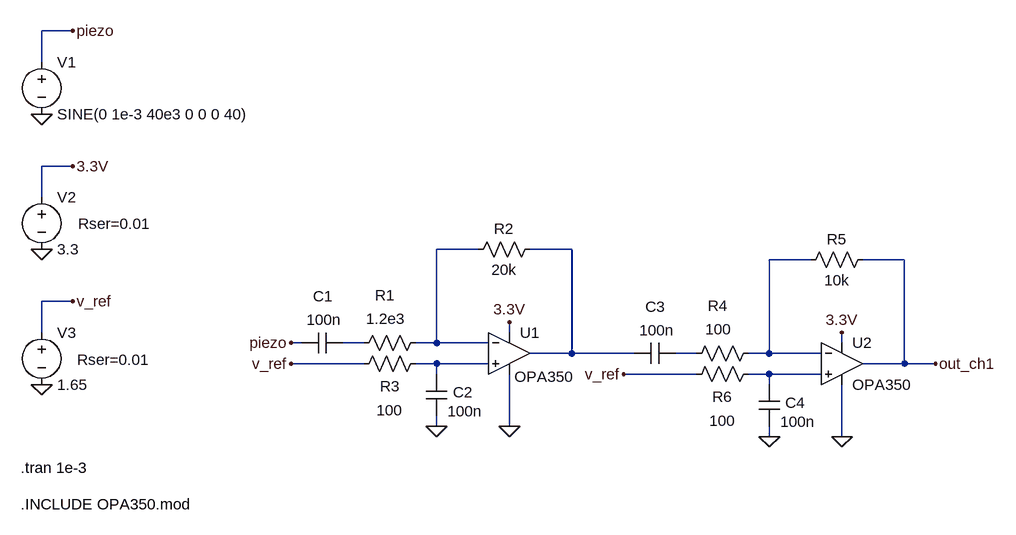
[diagram p0: schematic P6.asc]
P6.asc, the LTspice schematic file:
Version 4
SHEET 1 1124 680
WIRE -688 -96 -736 -96
WIRE -736 -48 -736 -96
WIRE -688 112 -736 112
WIRE -736 160 -736 112
WIRE -64 240 -128 240
WIRE 80 240 16 240
WIRE 448 256 384 256
WIRE 592 256 528 256
WIRE -688 320 -736 320
WIRE -736 368 -736 320
WIRE -16 368 -16 352
WIRE -336 384 -352 384
WIRE -240 384 -272 384
WIRE -128 384 -128 240
WIRE -128 384 -160 384
WIRE -48 384 -128 384
WIRE 496 384 496 368
WIRE 80 400 80 240
WIRE 80 400 16 400
WIRE 176 400 80 400
WIRE 272 400 240 400
WIRE 384 400 384 256
WIRE 384 400 352 400
WIRE 464 400 384 400
WIRE -240 416 -352 416
WIRE -128 416 -160 416
WIRE -48 416 -128 416
WIRE 592 416 592 256
WIRE 592 416 528 416
WIRE 640 416 592 416
WIRE -128 432 -128 416
WIRE 272 432 160 432
WIRE 384 432 352 432
WIRE 464 432 384 432
WIRE 384 448 384 432
WIRE -128 512 -128 496
WIRE -16 512 -16 432
WIRE 384 528 384 512
WIRE 496 528 496 448
FLAG -736 32 0
FLAG -688 -96 piezo
FLAG -736 240 0
FLAG -688 112 3.3V
FLAG -16 512 0
FLAG -16 352 3.3V
FLAG -736 448 0
FLAG -688 320 v_ref
FLAG -352 384 piezo
FLAG -352 416 v_ref
FLAG -128 512 0
FLAG 496 528 0
FLAG 496 368 3.3V
FLAG 160 432 v_ref
FLAG 384 528 0
FLAG 640 416 out_ch1
SYMBOL voltage -736 -64 R0
WINDOW 123 0 0 Left 2
WINDOW 39 0 0 Left 2
SYMATTR InstName V1
SYMATTR Value SINE(0 1e-3 40e3 0 0 0 40)
SYMBOL voltage -736 144 R0
WINDOW 123 0 0 Left 2
WINDOW 39 56 57 Left 2
SYMATTR SpiceLine Rser=0.01
SYMATTR InstName V2
SYMATTR Value 3.3
SYMBOL voltage -736 352 R0
WINDOW 123 0 0 Left 2
WINDOW 39 55 58 Left 2
SYMATTR SpiceLine Rser=0.01
SYMATTR InstName V3
SYMATTR Value 1.65
SYMBOL res -144 368 R90
WINDOW 0 -42 63 VBottom 2
WINDOW 3 -37 62 VTop 2
SYMATTR InstName R1
SYMATTR Value 1.2e3
SYMBOL cap -272 368 R90
WINDOW 0 -40 31 VBottom 2
WINDOW 3 -35 29 VTop 2
SYMATTR InstName C1
SYMATTR Value 100n
SYMBOL res 32 224 R90
WINDOW 0 0 56 VBottom 2
WINDOW 3 32 56 VTop 2
SYMATTR InstName R2
SYMATTR Value 20k
SYMBOL res -144 400 R90
WINDOW 0 66 56 VBottom 2
WINDOW 3 72 56 VTop 2
SYMATTR InstName R3
SYMATTR Value 100
SYMBOL cap -144 432 R0
WINDOW 0 41 28 Left 2
WINDOW 3 33 57 Left 2
SYMATTR InstName C2
SYMATTR Value 100n
SYMBOL Opamps\\opamp2 -16 336 R0
WINDOW 3 8 100 Left 2
SYMATTR InstName U1
SYMATTR Value OPA350
SYMBOL res 368 384 R90
WINDOW 0 -42 63 VBottom 2
WINDOW 3 -37 62 VTop 2
SYMATTR InstName R4
SYMATTR Value 100
SYMBOL cap 240 384 R90
WINDOW 0 -40 31 VBottom 2
WINDOW 3 -35 29 VTop 2
SYMATTR InstName C3
SYMATTR Value 100n
SYMBOL res 544 240 R90
WINDOW 0 0 56 VBottom 2
WINDOW 3 32 56 VTop 2
SYMATTR InstName R5
SYMATTR Value 10k
SYMBOL res 368 416 R90
WINDOW 0 66 56 VBottom 2
WINDOW 3 72 56 VTop 2
SYMATTR InstName R6
SYMATTR Value 100
SYMBOL cap 368 448 R0
WINDOW 0 41 28 Left 2
WINDOW 3 33 57 Left 2
SYMATTR InstName C4
SYMATTR Value 100n
SYMBOL Opamps\\opamp2 496 352 R0
SYMATTR InstName U2
SYMATTR Value OPA350
TEXT -768 576 Left 2 !.tran 1e-3
TEXT -768 632 Left 2 !.INCLUDE OPA350.mod

The netlist it stands for:
* P6.asc
V1 piezo 0 SINE(0 1e-3 40e3 0 0 0 40)
V2 3.3V 0 3.3 Rser=0.01
V3 v_ref 0 1.65 Rser=0.01
R1 N001 N004 1.2e3
C1 N004 piezo 100n
R2 N002 N001 20k
R3 N006 v_ref 100
C2 N006 0 100n
XU1 N006 N001 3.3V 0 N002 OPA350  ; pins In+ In- V+ V- OUT
R4 N003 N005 100
C3 N005 N002 100n
R5 out_ch1 N003 10k
R6 N007 v_ref 100
C4 N007 0 100n
XU2 N007 N003 3.3V 0 out_ch1 OPA350  ; pins In+ In- V+ V- OUT
.tran 1e-3
.INCLUDE OPA350.mod
.backanno
.end

* Results of the author's LTspice run, read from the files saved beside the schematic
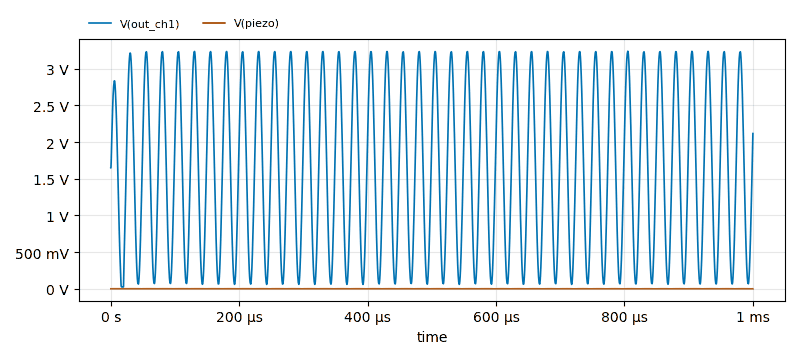
[diagram p1: Transient Analysis of P6.asc, plotted from the saved traces]
* Transient Analysis, 1 run:
*   V(out_ch1): min 24.19 mV, max 3.24 V, average 1.644 V, rms 1.989 V, last 2.118 V
*   V(piezo): min -998.5 µV, max 997.6 µV, average 55.7 nV, rms 701.4 µV, last 0 V